# Altium schematic sheet Sheet1.SchDoc
size A3; SheetNumber: 2; SheetTotal: 2
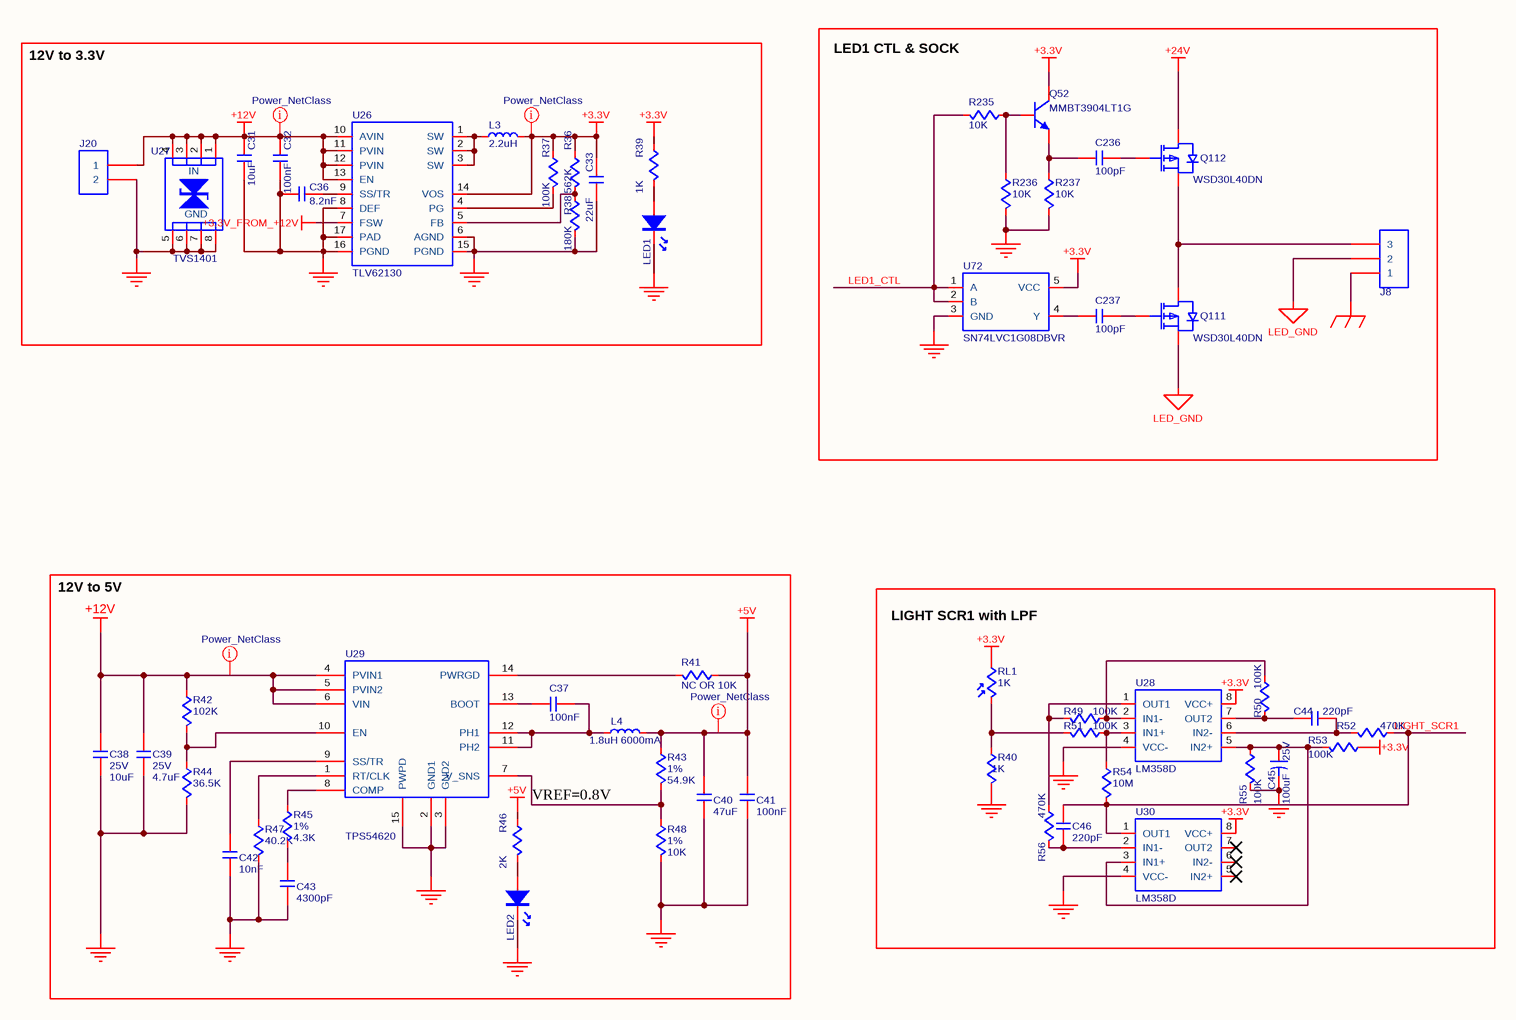
[diagram p0: Sheet1.SchDoc]

## Parts
C31  value 10uF  [C0805]  (hidden comment: C-NOMO)
C32  value 100nF  [C0402]  (hidden comment: C-NOMO)
C33  value 22uF  [C0805]  (hidden comment: C-NOMO)
C36  value 8.2nF  [C0402]  (hidden comment: C-NOMO)
C37  value 100nF  [C0402]  (hidden comment: C-NOMO)
C38  value 10uF  voltage: 25V  [C0805]  (hidden comment: C-NOMO)
C39  value 4.7uF  voltage: 25V  [C0805]  (hidden comment: C-NOMO)
C40  value 47uF  [C0805]  (hidden comment: C-NOMO)
C41  value 100nF  [C0402]  (hidden comment: C-NOMO)
C42  value 10nF  [C0402]  (hidden comment: C-NOMO)
C43  value 4300pF  [C0402]  (hidden comment: C-NOMO)
C44  value 220pF  [C0603]  (hidden comment: C-NOMO)
C45  value 100uF  voltage: 25V  [C7343]  (hidden comment: C-POL)
C46  value 220pF  [C0603]  (hidden comment: C-NOMO)
C236  value 100pF  [C0603]  (hidden comment: C-NOMO)
C237  value 100pF  [C0603]  (hidden comment: C-NOMO)
J8  HDR1X3  [HDR1X3]  (value not drawn)
J20  HDR1X2  [KF301-5.0-2P]  (value not drawn)
L3  value 2.2uH  [FXL0624]  (hidden comment: L)
L4  value 1.8uH 6000mA  [FXL0624]  (hidden comment: L)
LED1  LED  [LED0603]  (value not drawn)
LED2  LED  [LED0603]  (value not drawn)
Q52  MMBT3904LT1G  [SOT-23]
Q111  WSD30L40DN  [WSD30L40DN]
Q112  WSD30L40DN  [WSD30L40DN]
R36  value 562K  [R0402]  (hidden comment: R)
R37  value 100K  [R0402]  (hidden comment: R)
R38  value 180K  [R0402]  (hidden comment: R)
R39  value 1K  [R0402]  (hidden comment: R)
R40  value 1K  [R0402]  (hidden comment: R)
R41  value NC OR 10K  [R0402]  (hidden comment: R)
R42  value 102K  [R0402]  (hidden comment: R)
R43  value 54.9K  precision: 1%  [R0603]  (hidden comment: R)
R44  value 36.5K  [R0402]  (hidden comment: R)
R45  value 4.3K  precision: 1%  [R0402]  (hidden comment: R)
R46  value 2K  [R0402]  (hidden comment: R)
R47  value 40.2K  [R0402]  (hidden comment: R)
R48  value 10K  precision: 1%  [R0603]  (hidden comment: R)
R49  value 100K  [R0402]  (hidden comment: R)
R50  value 100K  [R0402]  (hidden comment: R)
R51  value 100K  [R0402]  (hidden comment: R)
R52  value 470K  [R0402]  (hidden comment: R)
R53  value 100K  [R0402]  (hidden comment: R)
R54  value 10M  [R0402]  (hidden comment: R)
R55  value 100K  [R0402]  (hidden comment: R)
R56  value 470K  [R0402]  (hidden comment: R)
R235  value 10K  [R0402]  (hidden comment: R)
R236  value 10K  [R0402]  (hidden comment: R)
R237  value 10K  [R0402]  (hidden comment: R)
RL1  value 1K  [R0402]  (hidden comment: RL)
U26  TLV62130  [TLV62130]
U27  TVS1401  [TVS1401]
U28  LM358D
U29  TPS54620  [TPS54620]
U30  LM358D
U72  SN74LVC1G08DBVR  [SN74LVC1G08DBVR]

## Blocks framed on the sheet
12V to 3.3V: C31-C33 C36 J20 L3 LED1 R36-R39 U26 U27
LED1 CTL & SOCK: C236 C237 J8 Q52 Q111 Q112 R235-R237 U72
VREF=0.8V: C37-C43 L4 LED2 R41-R48 U29
LIGHT SCR1 with LPF: C44-C46 R40 R49-R56 RL1 U28 U30

## Nets
123: J8.1
+3.3V: C33.1 L3.2 Q52.3(C) R36.2 R37.2 R39.2 R53.2 RL1.2 U26.14(VOS) U28.8(VCC+) U30.8(VCC+) U72.5(VCC)
+3.3V_FROM_+12V: U26.7(FSW)
+5V: C40.1 C41.1 L4.2 R41.2 R43.2 R46.2
+12V: C31.2 C32.2 C38.2 C39.2 J20.1 R42.2 U26.10(AVIN) U26.11(PVIN) U26.12(PVIN) U26.13(EN) U27.1(IN) U27.2(IN) U27.3(IN) U27.4(IN) U29.4(PVIN1) U29.5(PVIN2) U29.6(VIN)
+24V: Q112.D
DGND: C31.1 C32.1 C33.2 C36.2 J20.2 LED1.1 LED2.1 R38.1 U26.6(AGND) U26.8(DEF) U26.15(PGND) U26.16(PGND) U26.17(PAD) U27.5(GND) U27.6(GND) U27.7(GND) U27.8(GND)
GND: C38.1 C39.1 C40.2 C41.2 C42.1 C43.1 C45.2 R40.1 R44.1 R47.1 R48.1 R55.1 R236.1 R237.1 U28.4(VCC-) U29.2(GND1) U29.3(GND2) U29.15(PWPD) U30.4(VCC-) U72.3(GND)
LED_GND: J8.2 Q111.S
LED1_CTL: R235.1 U72.1(A) U72.2(B)
LIGHT_SCR1: C46.1 R52.2 R54.1 U30.1(OUT1)
NetC36_1: C36.1 U26.9(SS/TR)
NetC37_1: C37.1 L4.1 U29.11(PH2) U29.12(PH1)
NetC37_2: C37.2 U29.13(BOOT)
NetC42_2: C42.2 U29.9(SS/TR)
NetC43_2: C43.2 R45.1
NetC44_1: C44.1 R50.1 U28.7(OUT2)
NetC44_2: C44.2 R52.1 U28.6(IN2-)
NetC45_1: C45.1 R53.1 R55.2 U28.5(IN2+) U30.3(IN1+)
NetC46_2: C46.2 R56.1 U30.2(IN1-)
NetC236_1: C236.1 Q52.2(E) R237.2
NetC236_2: C236.2 Q112.G
NetC237_1: C237.1 U72.4(Y)
NetC237_2: C237.2 Q111.G
NetJ8_3: J8.3 Q111.D Q112.S
NetL3_1: L3.1 U26.1(SW) U26.2(SW) U26.3(SW)
NetLED1_2: LED1.2 R39.1
NetLED2_2: LED2.2 R46.1
NetQ52_1: Q52.1(B) R235.2 R236.2
NetR36_1: R36.1 R38.2 U26.5(FB)
NetR37_1: R37.1 U26.4(PG)
NetR40_2: R40.2 R51.1 RL1.1
NetR41_1: R41.1 U29.14(PWRGD)
NetR42_1: R42.1 R44.2 U29.10(EN)
NetR43_1: R43.1 R48.2 U29.7(V_SNS)
NetR45_2: R45.2 U29.8(COMP)
NetR47_2: R47.2 U29.1(RT/CLK)
NetR49_1: R49.1 R56.2 U28.1(OUT1)
NetR49_2: R49.2 R50.2 U28.2(IN1-)
NetR51_2: R51.2 R54.2 U28.3(IN1+)

Not connected (* = marked no-connect by the designer): U30 5(IN2+)* 6(IN2-)* 7(OUT2)*

## Layout directives
net class Power_NetClass: +3.3V, +5V, +12V

## Notes on the sheet
- 12V to 5V

## Library data of the parts
C31-C33 C36 C37 C40-C44 C46 C236 C237 = C-NOMO: voltage: 25V; precision: 5%
C38 C39 = C-NOMO: precision: 5%
L3 L4 = L: Code_IEC: 1005; Published: 8-Jun-2000; LatestRevisionDate: 29-May-2009; LatestRevisionNote: IPC-7351 Footprint Added.; PackageReference: 0402-A; Publisher: Altium Limited; PackageDescription: Chip Inductor; Code_JEITA: 0402
Q52 = NPN: Supplier 1: LCSC; Supplier Part Number 1: C260863
R36-R42 R44 R46 R47 R49-R56 R235-R237 = R: precision: 1%
RL1 = RL: precision: 1%
J8 = HDR1X3: Supplier 1: LCSC; Supplier Part Number 1: C474884; Supplier 2: LCSC; Supplier Part Number 2: C609572
J20 = HDR1X2: Supplier 1: LCSC; Supplier Part Number 1: C474881; Supplier 2: LCSC; Supplier Part Number 2: C225477; Supplier 3: LCSC; Supplier Part Number 3: C20079
Q111 Q112 = WSD30L40DN: Supplier 1: LCSC; Supplier Part Number 1: C148390
U26 = TLV62130: Supplier 1: LCSC; Supplier Part Number 1: C122479
U27 = TVS1401: Supplier 1: LCSC; Supplier Part Number 1: C1849891
U28 U30 = LM358D: Supplier 1: LCSC; Supplier Part Number 1: C2936099
U72 = SN74LVC1G08DBVR: Supplier 1: LCSC; Supplier Part Number 1: C434068